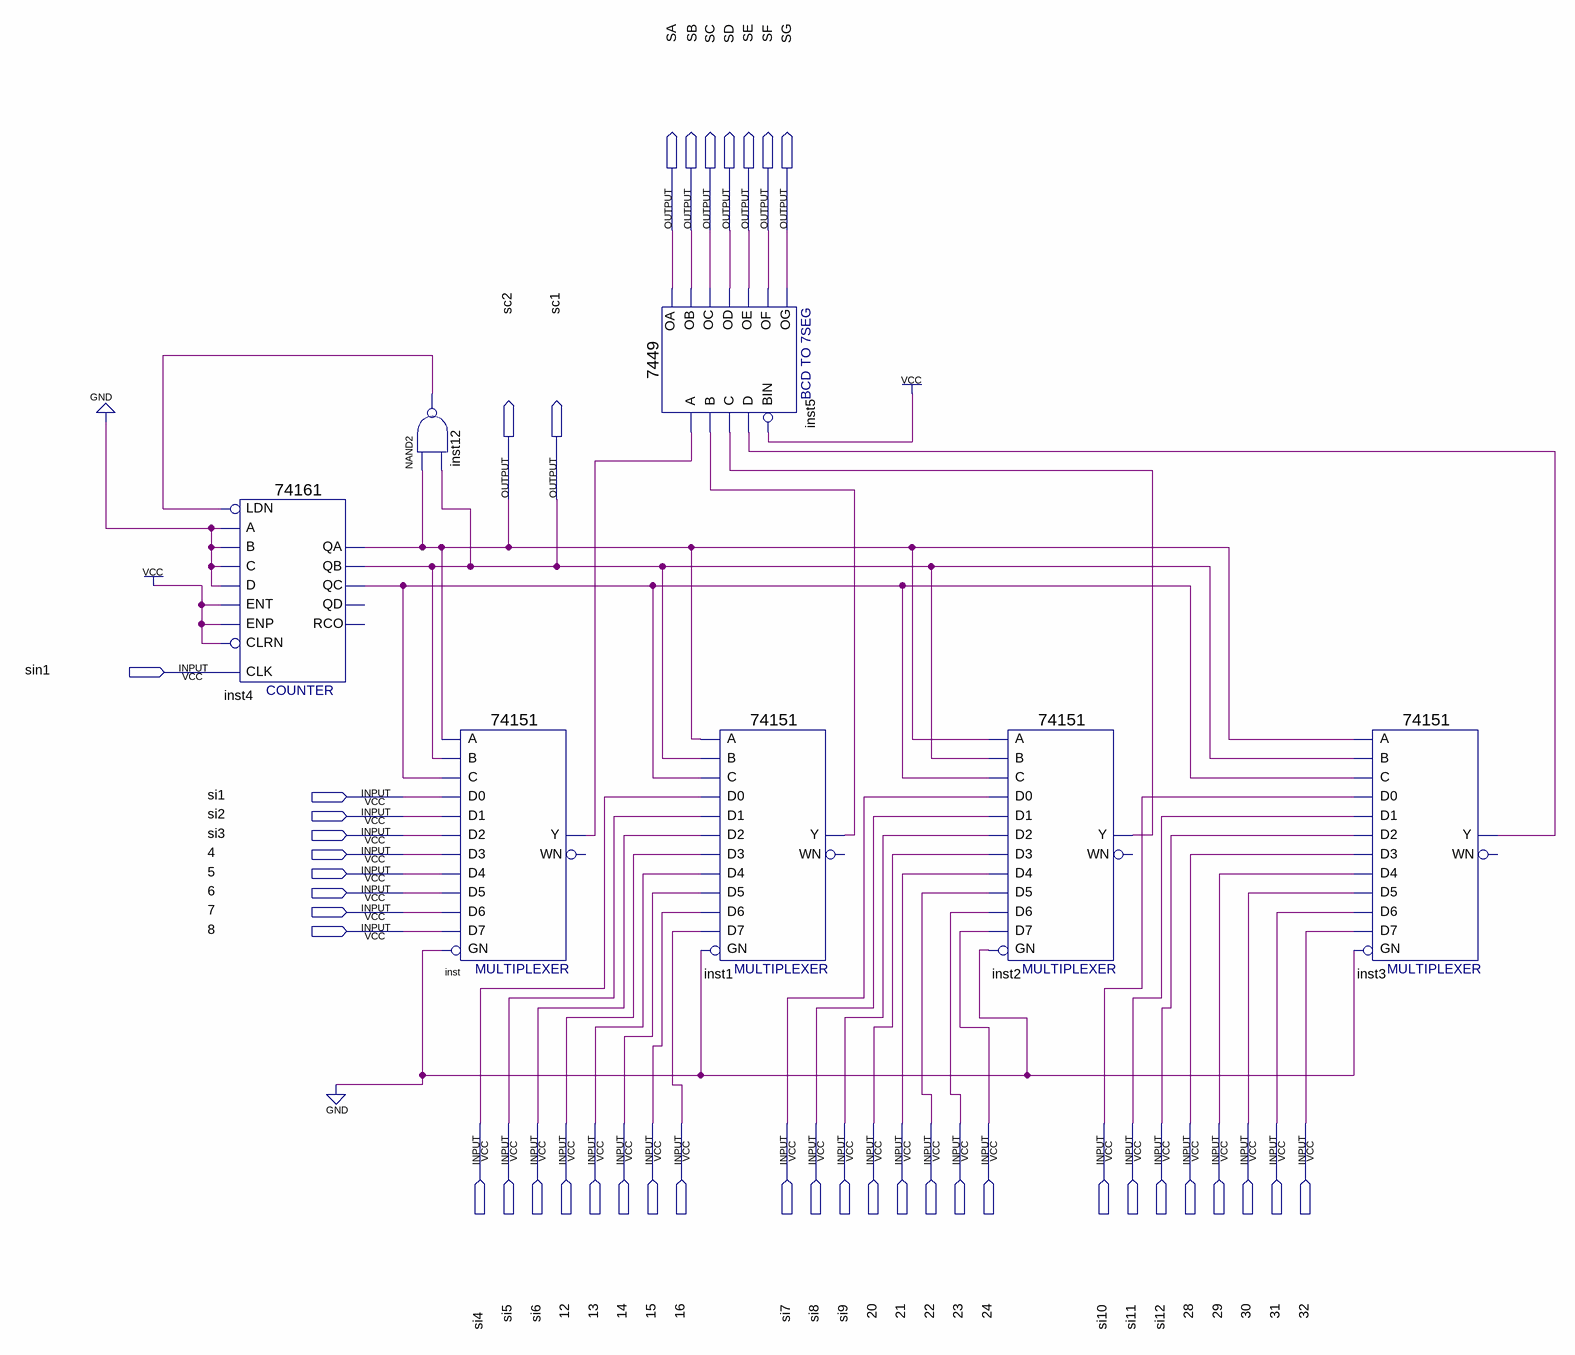
[diagram p0: schematic sheet]
// Quartus schematic scan.bdf as structural Verilog: 7 symbols, 42 pins
module scan (
  input  sin1,
  input  si1,
  input  si2,
  input  si3,
  input  \4 ,
  input  \5 ,
  input  \6 ,
  input  \7 ,
  input  \8 ,
  input  si4,
  input  si5,
  input  si6,
  input  \12 ,
  input  \13 ,
  input  \14 ,
  input  \15 ,
  input  \16 ,
  input  si7,
  input  si8,
  input  si9,
  input  \20 ,
  input  \21 ,
  input  \22 ,
  input  \23 ,
  input  \24 ,
  input  si10,
  input  si11,
  input  si12,
  input  \28 ,
  input  \29 ,
  input  \30 ,
  input  \31 ,
  input  \32 ,
  output SA,
  output SB,
  output SC,
  output SD,
  output SE,
  output SF,
  output SG,
  output sc2,
  output sc1
);

  wire inst1_y, inst2_y, inst3_y, inst4_qc, inst12_out, inst_y;

  \74161  inst4 (
    .CLRN(1'b1), .CLK(sin1), .ENP(1'b1), .LDN(inst12_out), .A(1'b0), .D(1'b0), .ENT(1'b1), .B(1'b0),
    .C(1'b0), .QC(inst4_qc), .QB(sc1), .QA(sc2));  // open: QD, RCO
  nand inst12 (inst12_out, sc2, sc1);
  \74151  inst (
    .GN(1'b0), .C(inst4_qc), .B(sc1), .A(sc2), .D5(\6 ), .D0(si1), .D1(si2), .D4(\5 ), .D3(\4 ), .D2(si3),
    .D6(\7 ), .D7(\8 ), .Y(inst_y));  // open: WN
  \7449  inst5 (
    .A(inst_y), .C(inst2_y), .B(inst1_y), .D(inst3_y), .BIN(1'b1), .OC(SC), .OD(SD), .OF(SF), .OG(SG),
    .OB(SB), .OA(SA), .OE(SE));
  \74151  inst1 (
    .GN(1'b0), .C(inst4_qc), .B(sc1), .A(sc2), .D5(\14 ), .D0(si4), .D1(si5), .D4(\13 ), .D3(\12 ), .D2(si6),
    .D6(\15 ), .D7(\16 ), .Y(inst1_y));  // open: WN
  \74151  inst2 (
    .GN(1'b0), .C(inst4_qc), .B(sc1), .A(sc2), .D5(\22 ), .D0(si7), .D1(si8), .D4(\21 ), .D3(\20 ), .D2(si9),
    .D6(\23 ), .D7(\24 ), .Y(inst2_y));  // open: WN
  \74151  inst3 (
    .GN(1'b0), .C(inst4_qc), .B(sc1), .A(sc2), .D5(\30 ), .D0(si10), .D1(si11), .D4(\29 ), .D3(\28 ),
    .D2(si12), .D6(\31 ), .D7(\32 ), .Y(inst3_y));  // open: WN
endmodule
